# EAGLE design LTC3105_Charger (EAGLE 7.2.0)
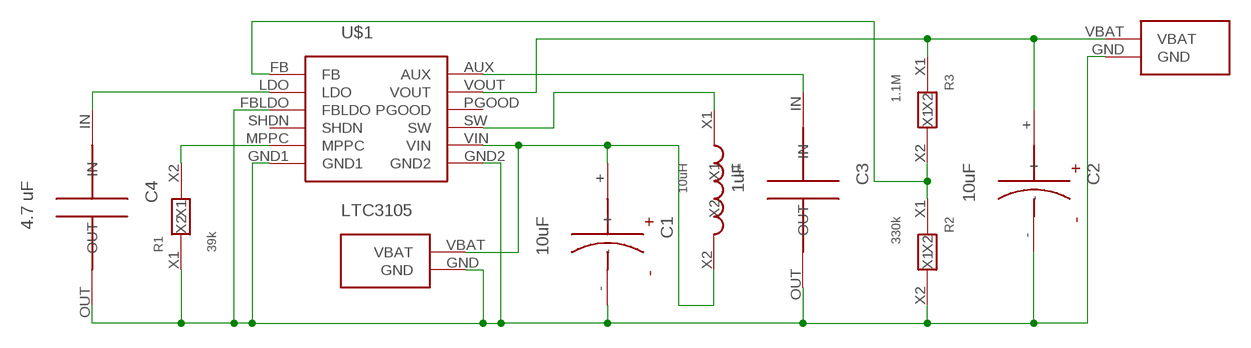
[diagram p0: schematic, sheet 1]

## Parts
C1  10uF  C_ELT_2MM  [C_ELT_2MM]
C2  10uF  C_ELT_2MM  [C_ELT_2MM]
C3  1uF  C_CER_5MM  [C_CER_5MM]
C4  4.7 uF  C_CER_5MM  [C_CER_5MM]
L1  10uH  L_10X3  [L_10X3]
R1  39k  R_6X2  [R_6X2]
R2  330k  R_6X2  [R_6X2]
R3  1.1M  R_6X2  [R_6X2]
U$1  LTC3105  [LTC3105]
U$10  BAT_PLUG  [BAT_PLUG]
U$11  BAT_PLUG  [BAT_PLUG]

## Nets
N$1: C1.- C2.- C3.OUT C4.OUT R1.X1 R2.X2 U$1.FBLDO U$1.GND1 U$1.GND2 U$10.GND U$11.GND
N$2: C4.IN U$1.LDO
N$3: R1.X2 U$1.MPPC
N$4: C3.IN U$1.AUX
N$5: L1.X1 U$1.SW
N$6: R2.X1 R3.X2 U$1.FB
N$7: C2.+ R3.X1 U$1.VOUT U$11.VBAT
N$10: C1.+ L1.X2 U$1.VIN U$10.VBAT
Unconnected: U$1.PGOOD U$1.SHDN

## Library data of the parts
C1 C2 = MyDuino:C_ELT_2MM
C3 C4 = MyDuino:C_CER_5MM
L1 = MyDuino:L_10X3
R1-R3 = MyDuino:R_6X2
U$1 = MyDuino:LTC3105
U$10 U$11 = MyDuino:BAT_PLUG

## Board
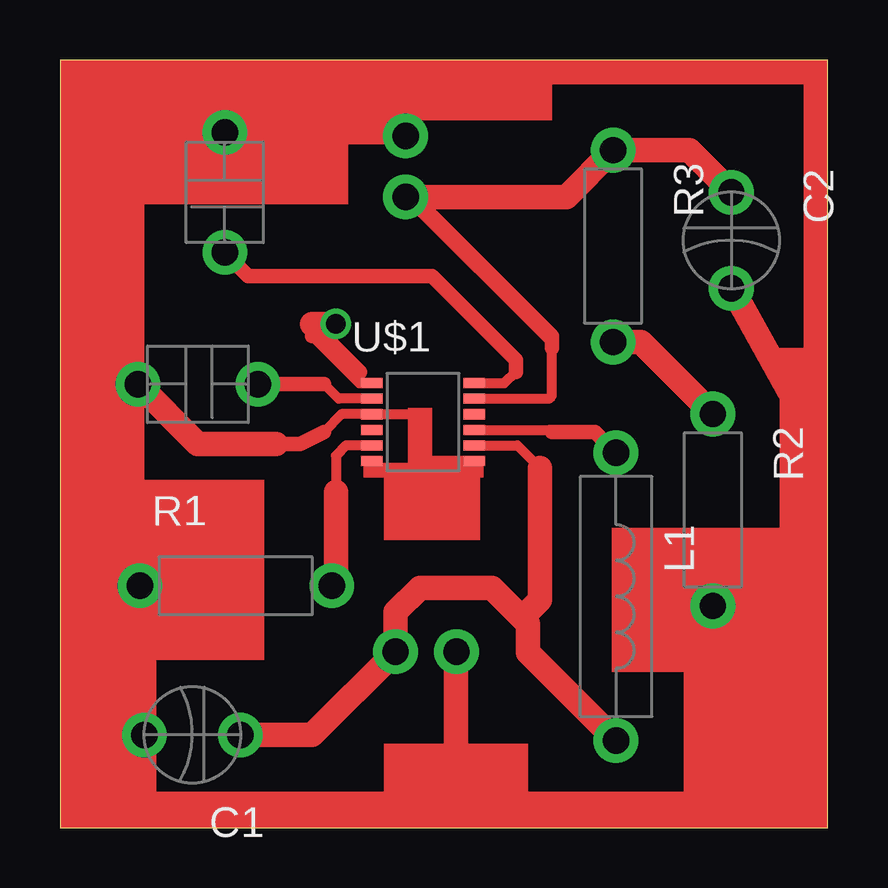
[diagram p1: board, top side]
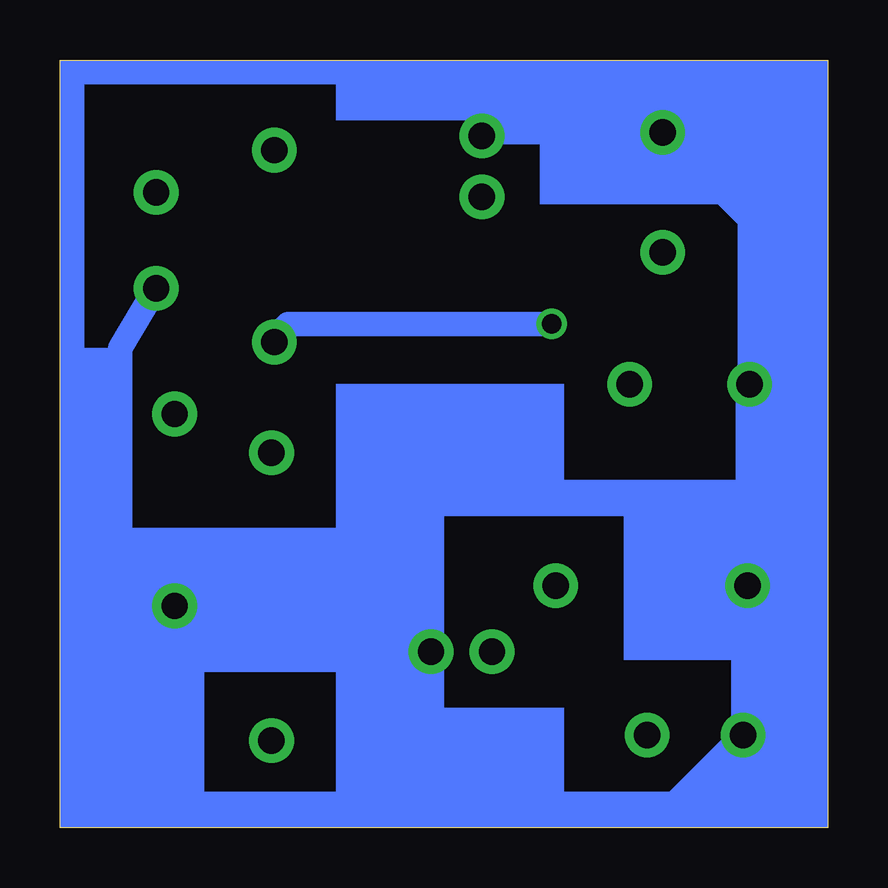
[diagram p2: board, bottom side, seen from below]

Size 32 x 32 mm. Coordinates in mm from the lower left corner, seen from the top.
Outline: 0,0 32,0 32,32 0,32 0,0
Copper layers (1*16): Top 0.035mm / dielectric 1.5mm / Bottom 0.035mm
Design rules "default *": minimum track width 15mil, minimum drill 24mil, track to track 8mil, track to pad 8mil, pad to pad 8mil, via to via 8mil, smd to smd 8mil, copper to edge 40mil, drill to drill 8mil, minimum pad ring 15mil, minimum via ring 8mil, stop-mask expansion 4mil, vias tented up to drill 0mil, thermal gap 10mil

### Footprints (pad centres in the part's own frame; a part is rotated, then mirrored left to right if it is on the bottom)
C_ELT_2MM = drill 1.1: + -2,0; - 2,0
C_CER_5MM = drill 1.1: IN -2.5,0; OUT 2.5,0
L_10X3 = drill 1.1: X1 -6,0; X2 6,0
R_6X2 = drill 1.1: X1 -4,0; X2 4,0
LTC3105 = smd 0.89 x 0.42: AUX 3.82,1.95; FB -0.45,1.95; FBLDO -0.45,0.65; GND1 -0.45,-1.3; GND2 3.82,-1.3; LDO -0.45,1.3; MPPC -0.45,-0.65; PGOOD 3.82,0.65; SHDN -0.45,0; SW 3.82,0; VIN 3.82,-0.65; VOUT 3.82,1.3
BAT_PLUG = drill 1.1: GND 0,0; VBAT 0,2.54

### Placement (x,y rotation side)
C1  5.52,3.86 180 top
C2  27.99,24.48 270 top
C3  6.87,26.48 90 top
C4  5.75,18.48 180 top
L1  23.18,9.63 270 top
R1  7.33,10.08 0 top
R2  27.22,13.24 270 top
R3  23.06,24.24 270 top
U$1  13.45,16.58 0 top
U$10  16.53,7.33 90 top
U$11  14.41,28.83 180 top

### Tracks (layer width: path | path; a pad name or v marks a point on that pad's centre or on a via)
N$1
  Top 0.406: 15,15 15,16.5 14.77,17.23 U$1.FBLDO 11.73,17.23 11,16.5 | 15,15 13.28,15 U$1.GND1 | U$1.GND2 15.28,15.28 15,15
  Top 0.61: 11,16.5 10,16 9,16
  Top 1.016: 9,16 5.73,16 C4.OUT
  Bottom 1.016: U$11.GND 14.26,28.98 C3.OUT 3.25,25.36 C4.OUT 3.33,18.4 R1.X1 3.52,9.89 C1.- 6.38,1 16.5,1 | C2.- 27.99,22.51 29.5,20 29.5,9.52 R2.X2 27.22,1.22 27,1 16.5,1 | 16.5,1 16.5,7.3 U$10.GND 16.53,1.03 16.5,1
N$2
  Top 0.406: U$1.LDO 11.62,17.88 11,18.5
  Top 0.61: 11,18.5 8.27,18.5 C4.IN
N$3
  Top 0.406: U$1.MPPC 11.93,15.93 11.5,15.5 11.5,14
  Top 1.016: 11.5,14 11.5,10.25 R1.X2
N$4
  Top 0.406: U$1.AUX 18.53,18.53 19,19
  Top 0.61: 19,19 19,19.5 15.5,23 7.85,23 C3.IN
N$5
  Top 0.406: U$1.SW 20.42,16.58 20.5,16.5
  Top 0.61: 20.5,16.5 22.31,16.5 L1.X1
N$6  (via drill 0.8 pad 1.27)
  Top 0.406: U$1.FB 12.47,18.53 10.5,20.5 10.5,21
  Top 0.61: 10.5,20.5 11,20.5 12.5,19
  Top 1.016: R3.X2 24.22,20.24 R2.X1 | v11.5,21 10.5,21
  Bottom 1.016: v11.5,21 22.5,21 23,20.5 R3.X2
N$7
  Top 0.406: U$1.VOUT 20.38,17.88 20.5,18 20.5,20 20.5,20.2 U$11.VBAT
  Top 0.61: 20.5,20 20.5,20.5 15,26
  Top 1.016: U$11.VBAT 21.11,26.29 R3.X1 26.23,28.24 C2.+
N$8
  Top 1.016: 28,22.5 30.5,18
N$10
  Top 0.406: U$1.VIN 19.07,15.93 20,15
  Top 1.016: C1.+ 10.52,3.86 U$10.VBAT 13.99,8.99 15,10 18,10 19.25,8.75 | 19.25,8.75 19.5,8.5 19.5,7.31 L1.X2 | 20,15 20,9.5 19.25,8.75
(copper drawn outside any net)
  shapes: Bottom area x17, Top area x18